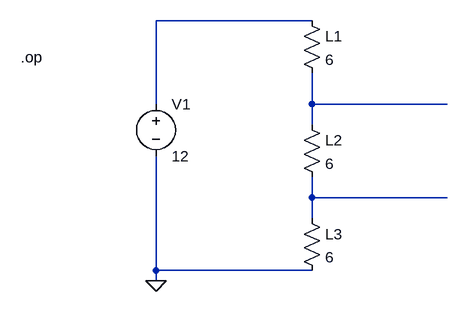
[diagram p0: schematic circuit.asc]
circuit.asc, the LTspice schematic file:
Version 4.1
SHEET 1 880 680
WIRE 256 48 16 48
WIRE 16 176 16 48
WIRE 256 176 256 128
WIRE 464 176 256 176
WIRE 256 208 256 176
WIRE 256 320 256 288
WIRE 464 320 256 320
WIRE 256 352 256 320
WIRE 16 432 16 256
WIRE 256 432 16 432
WIRE 16 448 16 432
FLAG 16 448 0
DATAFLAG 256 48 ""
DATAFLAG 256 176 ""
DATAFLAG 256 320 ""
DATAFLAG 256 432 ""
DATAFLAG 32 48 "-I(V1)"
SYMBOL voltage 16 160 R0
WINDOW 123 0 0 Left 0
WINDOW 39 0 0 Left 0
SYMATTR InstName V1
SYMATTR Value 12
SYMBOL res 240 32 R0
SYMATTR InstName L1
SYMATTR Value 6
SYMBOL res 240 192 R0
SYMATTR InstName L2
SYMATTR Value 6
SYMBOL res 240 336 R0
SYMATTR InstName L3
SYMATTR Value 6
TEXT -192 104 Left 2 !.op

The netlist it stands for:
* circuit.asc
V1 N001 0 12
R§L1 N001 N002 6
R§L2 N002 N003 6
R§L3 N003 0 6
.op
.backanno
.end